# EAGLE design kidstimer (EAGLE 7.7.0)
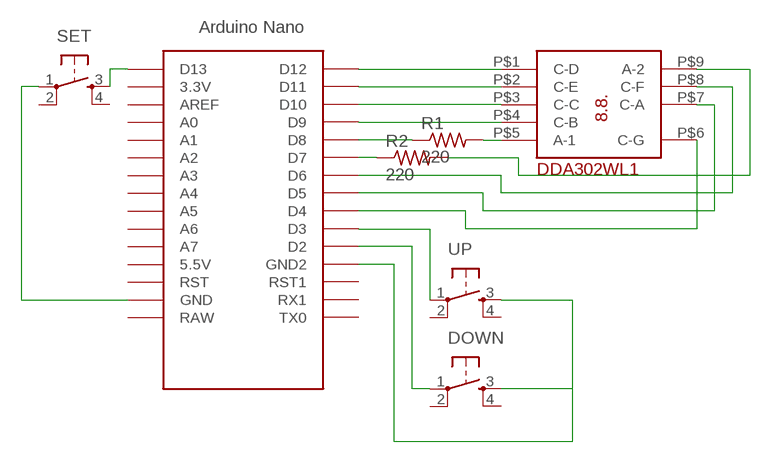
[diagram p0: schematic, sheet 1]

## Parts
DOWN  TAC_SWITCHPTH  [TACTILE-PTH]
R1  220  R-US_0207/10  [0207/10]
R2  220  R-US_0207/10  [0207/10]
SET  TAC_SWITCHPTH  [TACTILE-PTH]
U$1  DDA302WL1DIP9  [DIP9]
U$2  NANO  [NANO]
UP  TAC_SWITCHPTH  [TACTILE-PTH]

## Nets
N$1: U$1.P$1(C-D) U$2.D12
N$2: U$1.P$2(C-E) U$2.D11
N$3: U$1.P$3(C-C) U$2.D10
N$4: U$1.P$4(C-B) U$2.D9
N$5: R1.2 U$1.P$5(A-1)
N$6: U$1.P$6(C-G) U$2.D4
N$7: U$1.P$7(C-A) U$2.D5
N$8: U$1.P$8(C-F) U$2.D6
N$9: R2.2 U$1.P$9(A-2)
N$10: R2.1 U$2.D7
N$11: R1.1 U$2.D8
N$12: U$2.D3 UP.1
N$13: SET.1 U$2.GND
N$14: DOWN.1 U$2.D2
N$15: SET.3 U$2.D13
N$17: DOWN.3 U$2.GND1(GND2) UP.3
Unconnected: DOWN.2 DOWN.4 SET.2 SET.4 U$2.3.3V U$2.5V(5.5V) U$2.A0 U$2.A1 U$2.A2 U$2.A3 U$2.A4 U$2.A5 U$2.A6 U$2.A7 U$2.AREF U$2.ICSP1 U$2.ICSP2 U$2.ICSP3 U$2.ICSP4 U$2.ICSP5 U$2.ICSP6 U$2.RAW U$2.RST U$2.RST1 U$2.RX1 U$2.TX0 UP.2 UP.4

## Library data of the parts
DOWN SET UP = SparkFun-Retired:TAC_SWITCH: Momentary Switch Button commonly used for reset or general input. Spark Fun Electronics SKU : COM-00097 SMT- SWCH-08247
R1 R2 = rcl:R-US_: RESISTOR, American symbol
U$1 = yair:DDA302WL1: 2 digits 7 segments display common anode note that the DP are unavailble here. This is also for TOD320 3BMRL D12C04455 R
U$2 = Arduino-clone:NANO: Arduino Nano

## Board
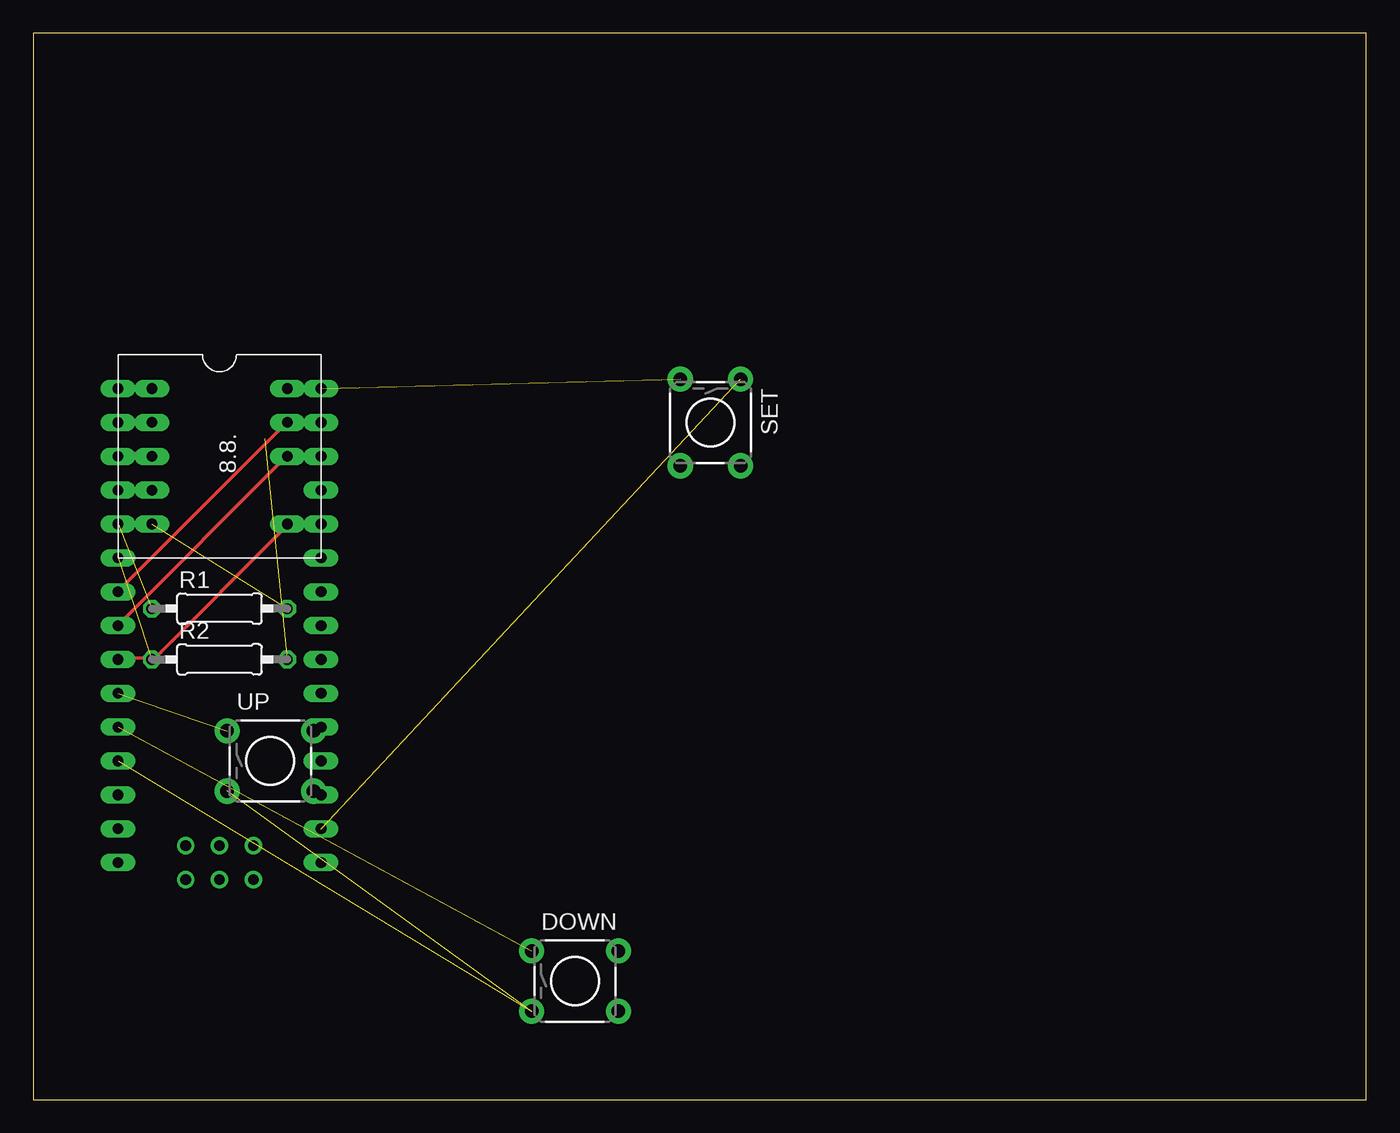
[diagram p1: board, top side]
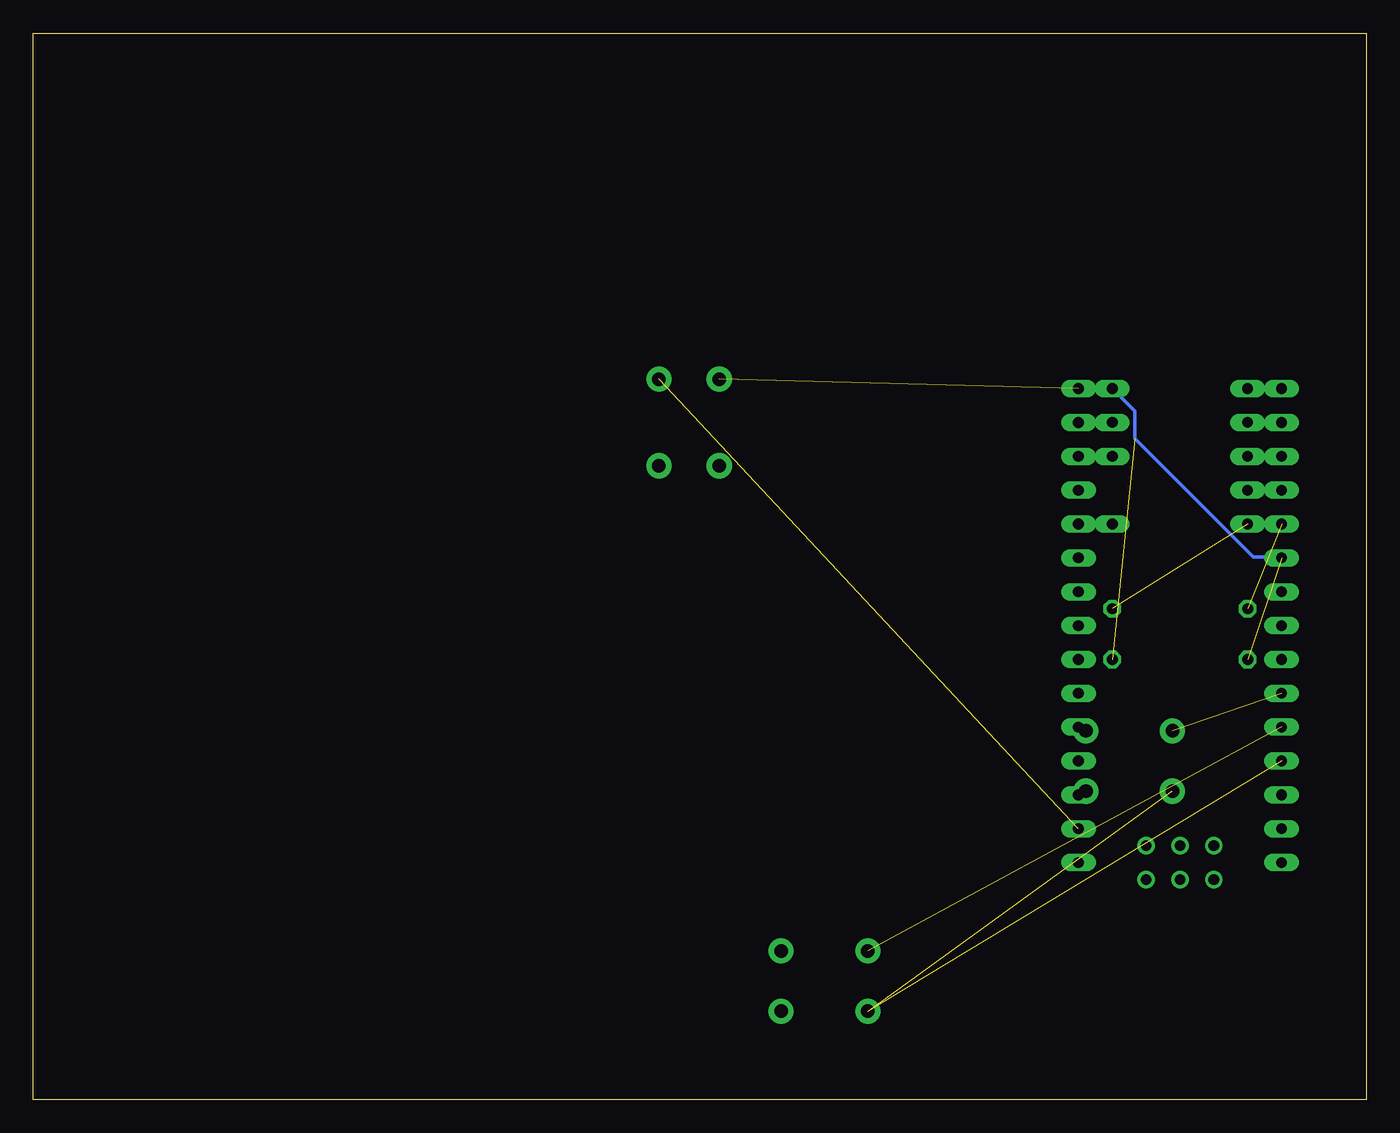
[diagram p2: board, bottom side, seen from below]

Size 100 x 80 mm. Coordinates in mm from the lower left corner, seen from the top.
Outline: 0,0 100,0 100,80 0,80 0,0
Copper layers (1*16): Top 0.035mm / dielectric 1.5mm / Bottom 0.035mm
Design rules "default": minimum track width 10mil, minimum drill 24mil, track to track 8mil, track to pad 8mil, pad to pad 8mil, via to via 8mil, smd to smd 8mil, copper to edge 40mil, drill to drill 8mil, minimum pad ring 10mil, minimum via ring 8mil, stop-mask expansion 4mil, vias tented up to drill 0mil, thermal gap 10mil

### Footprints (pad centres in the part's own frame; a part is rotated, then mirrored left to right if it is on the bottom)
TACTILE-PTH = drill 1.016 pad 1.88: 1 -3.251,2.261; 2 3.251,2.261; 3 -3.251,-2.261; 4 3.251,-2.261
0207/10 = drill 0.813 octagon: 1 -5.08,0; 2 5.08,0
DIP9 = drill 0.8 long: P$1 0,0; P$2 0,-2.54; P$3 0,-5.08; P$4 0,-7.62; P$5 0,-10.16; P$6 10.16,-10.16; P$7 10.16,-5.08; P$8 10.16,-2.54; P$9 10.16,0
NANO = drill 0.8 long: 3.3V -10.16,24.13; 5V -10.16,-1.27; A0 -10.16,19.05; A1 -10.16,16.51; A2 -10.16,13.97; A3 -10.16,11.43; A4 -10.16,8.89; A5 -10.16,6.35; A6 -10.16,3.81; A7 -10.16,1.27; AREF -10.16,21.59; D2 5.08,1.27; D3 5.08,3.81; D4 5.08,6.35; D5 5.08,8.89; D6 5.08,11.43; D7 5.08,13.97; D8 5.08,16.51; D9 5.08,19.05; D10 5.08,21.59; D11 5.08,24.13; D12 5.08,26.67; D13 -10.16,26.67; GND -10.16,-6.35; GND1 5.08,-1.27; RAW -10.16,-8.89; RST -10.16,-3.81; RST1 5.08,-3.81; RX1 5.08,-6.35; TX0 5.08,-8.89 | drill 0.8: ICSP1 -5.08,-10.16; ICSP2 -5.08,-7.62; ICSP3 -2.54,-10.16; ICSP4 -2.54,-7.62; ICSP5 0,-10.16; ICSP6 0,-7.62

### Placement (x,y rotation side)
DOWN  40.64,8.89 0 top
R1  13.97,36.83 0 top
R2  13.97,33.02 0 top
SET  50.8,50.8 270 top
U$1  8.89,53.34 0 top
U$2  11.43,26.67 0 bottom
UP  17.78,25.4 0 top

### Tracks (layer width: path | path; a pad name or v marks a point on that pad's centre or on a via)
N$1
  Top 0.254: U$2.D12 6.4,53.49 8.69,53.49 U$1.P$1
N$2
  Top 0.254: U$2.D11 6.4,50.98 8.69,50.98 U$1.P$2
N$3
  Top 0.254: U$2.D10 6.4,48.46 8.69,48.46 U$1.P$3
N$4
  Top 0.254: U$1.P$4 U$2.D9
N$5  (1 unrouted)
N$6
  Top 0.254: U$2.D4 6.4,33.15 9.14,33.15 18.97,42.98 U$1.P$6
N$7
  Top 0.254: U$2.D5 6.4,35.66 18.97,48.23 U$1.P$7
N$8
  Top 0.254: U$2.D6 6.4,38.18 18.97,50.75 U$1.P$8
N$9  (1 unrouted)
  Bottom 0.254: 6.4,40.69 8.46,40.69 17.37,49.61 17.37,51.66 U$1.P$9
N$10  (1 unrouted)
N$11  (1 unrouted)
N$12  (1 unrouted)
N$13  (1 unrouted)
N$14  (1 unrouted)
N$15  (1 unrouted)
N$17  (2 unrouted)